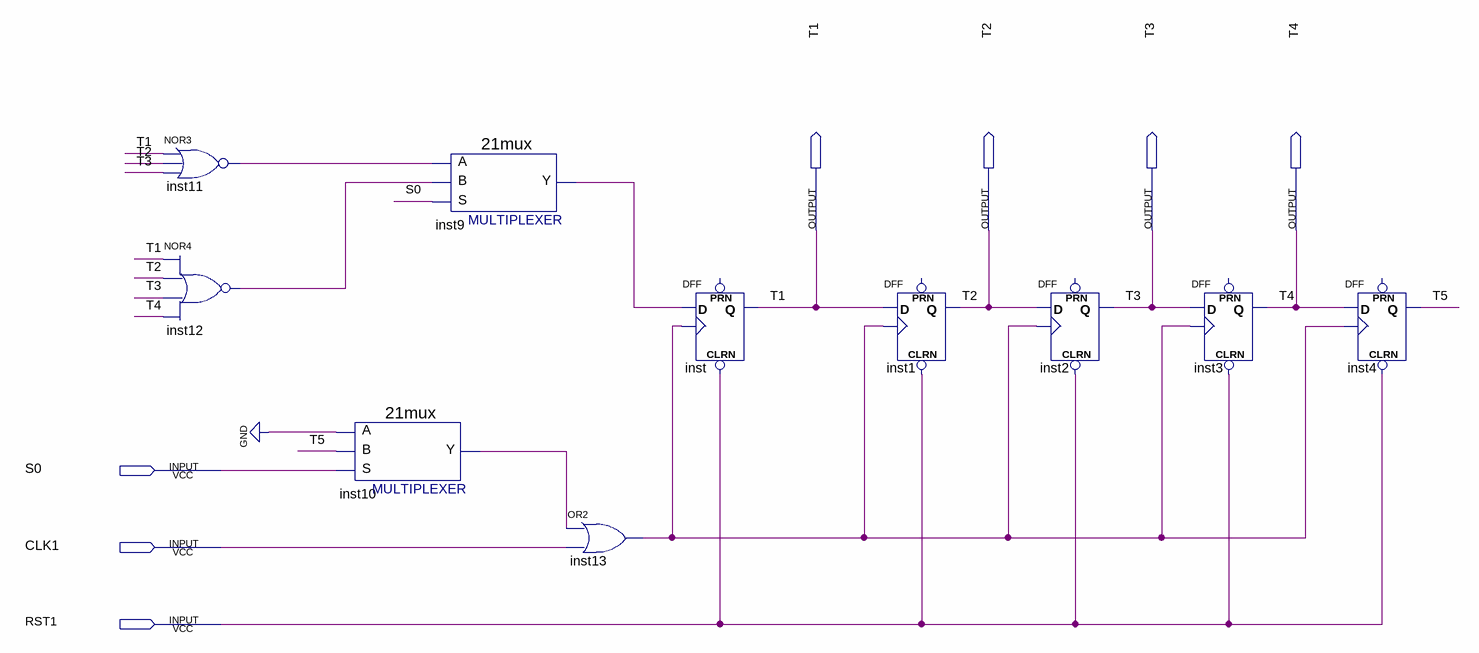
[diagram p0: schematic sheet]
// Quartus schematic timing1021.bdf as structural Verilog: 10 symbols, 7 pins
module timing1021 (
  input  S0,
  input  CLK1,
  input  RST1,
  output T1,
  output T2,
  output T3,
  output T4
);

  wire inst9_y, inst10_y, inst11_out, inst12_out, inst13_out, T5;

  nor inst11 (inst11_out, T1, T2, T3);
  nor inst12 (inst12_out, T1, T2, T3, T4);
  \21mux  inst10 (.S(S0), .B(T5), .A(1'b0), .Y(inst10_y));
  \21mux  inst9 (.S(S0), .B(inst12_out), .A(inst11_out), .Y(inst9_y));
  or inst13 (inst13_out, inst10_y, CLK1);
  DFF inst (.CLRN(RST1), .CLK(inst13_out), .D(inst9_y), .Q(T1));  // open: PRN
  DFF inst1 (.CLRN(RST1), .CLK(inst13_out), .D(T1), .Q(T2));  // open: PRN
  DFF inst2 (.CLRN(RST1), .CLK(inst13_out), .D(T2), .Q(T3));  // open: PRN
  DFF inst3 (.CLRN(RST1), .CLK(inst13_out), .D(T3), .Q(T4));  // open: PRN
  DFF inst4 (.CLRN(RST1), .CLK(inst13_out), .D(T4), .Q(T5));  // open: PRN
endmodule
